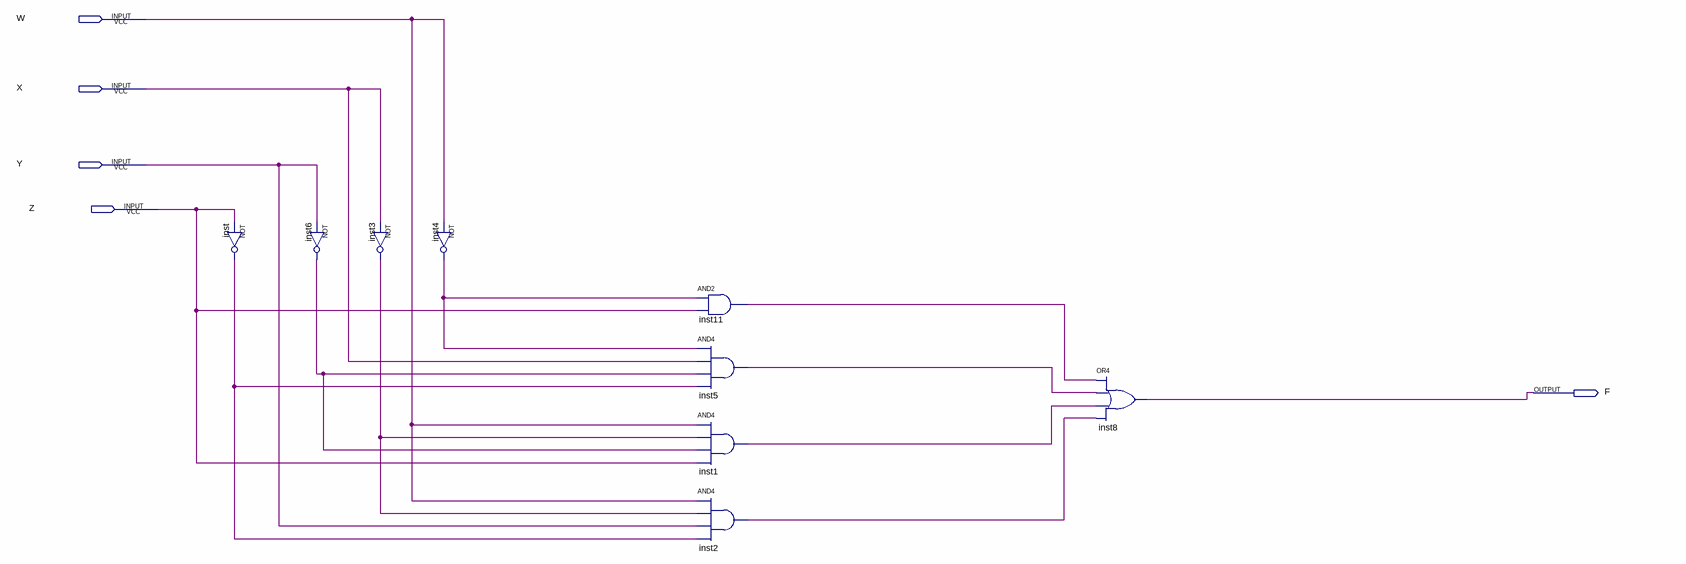
[diagram p0: schematic sheet]
// Quartus schematic labcomp.bdf as structural Verilog: 9 symbols, 5 pins
module labcomp (
  input  W,
  input  X,
  input  Y,
  input  Z,
  output F
);

  wire inst1_out, inst2_out, inst3_out, inst4_out, inst5_out, inst6_out, inst11_out, inst_out;

  not inst (inst_out, Z);
  not inst6 (inst6_out, Y);
  not inst3 (inst3_out, X);
  not inst4 (inst4_out, W);
  and inst11 (inst11_out, inst4_out, Z);
  and inst5 (inst5_out, inst4_out, X, inst6_out, inst_out);
  and inst1 (inst1_out, W, inst3_out, inst6_out, Z);
  and inst2 (inst2_out, W, inst3_out, Y, inst_out);
  or inst8 (F, inst11_out, inst5_out, inst1_out, inst2_out);
endmodule
